# Altium schematic sheet power_supply.SchDoc
size A4
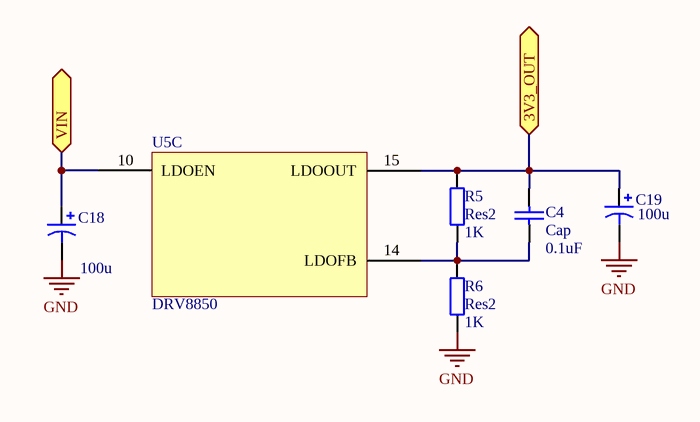
[diagram p0: power_supply.SchDoc]

## Parts
C4  Cap  value 0.1uF  [RAD-0.3]
C18  value 100u  [Tantalum_cap_D]
C19  value 100u  [Tantalum_cap_D]
R5  Res2  value 1K  [AXIAL-0.4]
R6  Res2  value 1K  [AXIAL-0.4]
U5  DRV8850  (part C of 3)

## Ports
3V3_OUT, VIN

## Nets
GND: C18.2 C19.2 R6.1
3V3_OUT: C4.2 C19.1 R5.2 U5.15(LDOOUT) ; port 3V3_OUT
VIN: C18.1 U5.10(LDOEN) ; port VIN
NetC4_1: C4.1 R5.1 R6.2 U5.14(LDOFB)

## Library data of the parts
C4 = Cap: Capacitor; Published: 8-Jun-2000; LatestRevisionDate: 17-Jul-2002; LatestRevisionNote: Re-released for DXP Platform.; PackageReference: RAD-0.3; Publisher: Altium Limited; PackageDescription: Radial Cap, Thru-Hole; 2 Leads; 0.3 in Pin Spacing
C18 C19 = Cap Pol1: Polarized Capacitor (Radial); Published: 8-Jun-2000; LatestRevisionDate: 17-Jul-2002; LatestRevisionNote: Re-released for DXP Platform.; PackageReference: RB7.6-15; Publisher: Altium Limited; PackageDescription: Polarized Capacitor (Radial); 2 Leads
R5 R6 = Res2: Resistor; Published: 8-Jun-2000; LatestRevisionDate: 17-Jul-2002; LatestRevisionNote: Re-released for DXP Platform.; PackageReference: AXIAL-0.4; Publisher: Altium Limited; PackageDescription: Axial Device, Thru-Hole; 2 Leads; 0.4 in Pin Spacing